# EasyEDA schematic 1-Schematic_RGB SENSOR PEN.json
TITLE: Sheet_1; REV: 1.0; Date: 2021-05-16; Sheet: 1/1; Drawn By: saravanan pushpakumar; Company: Your Company
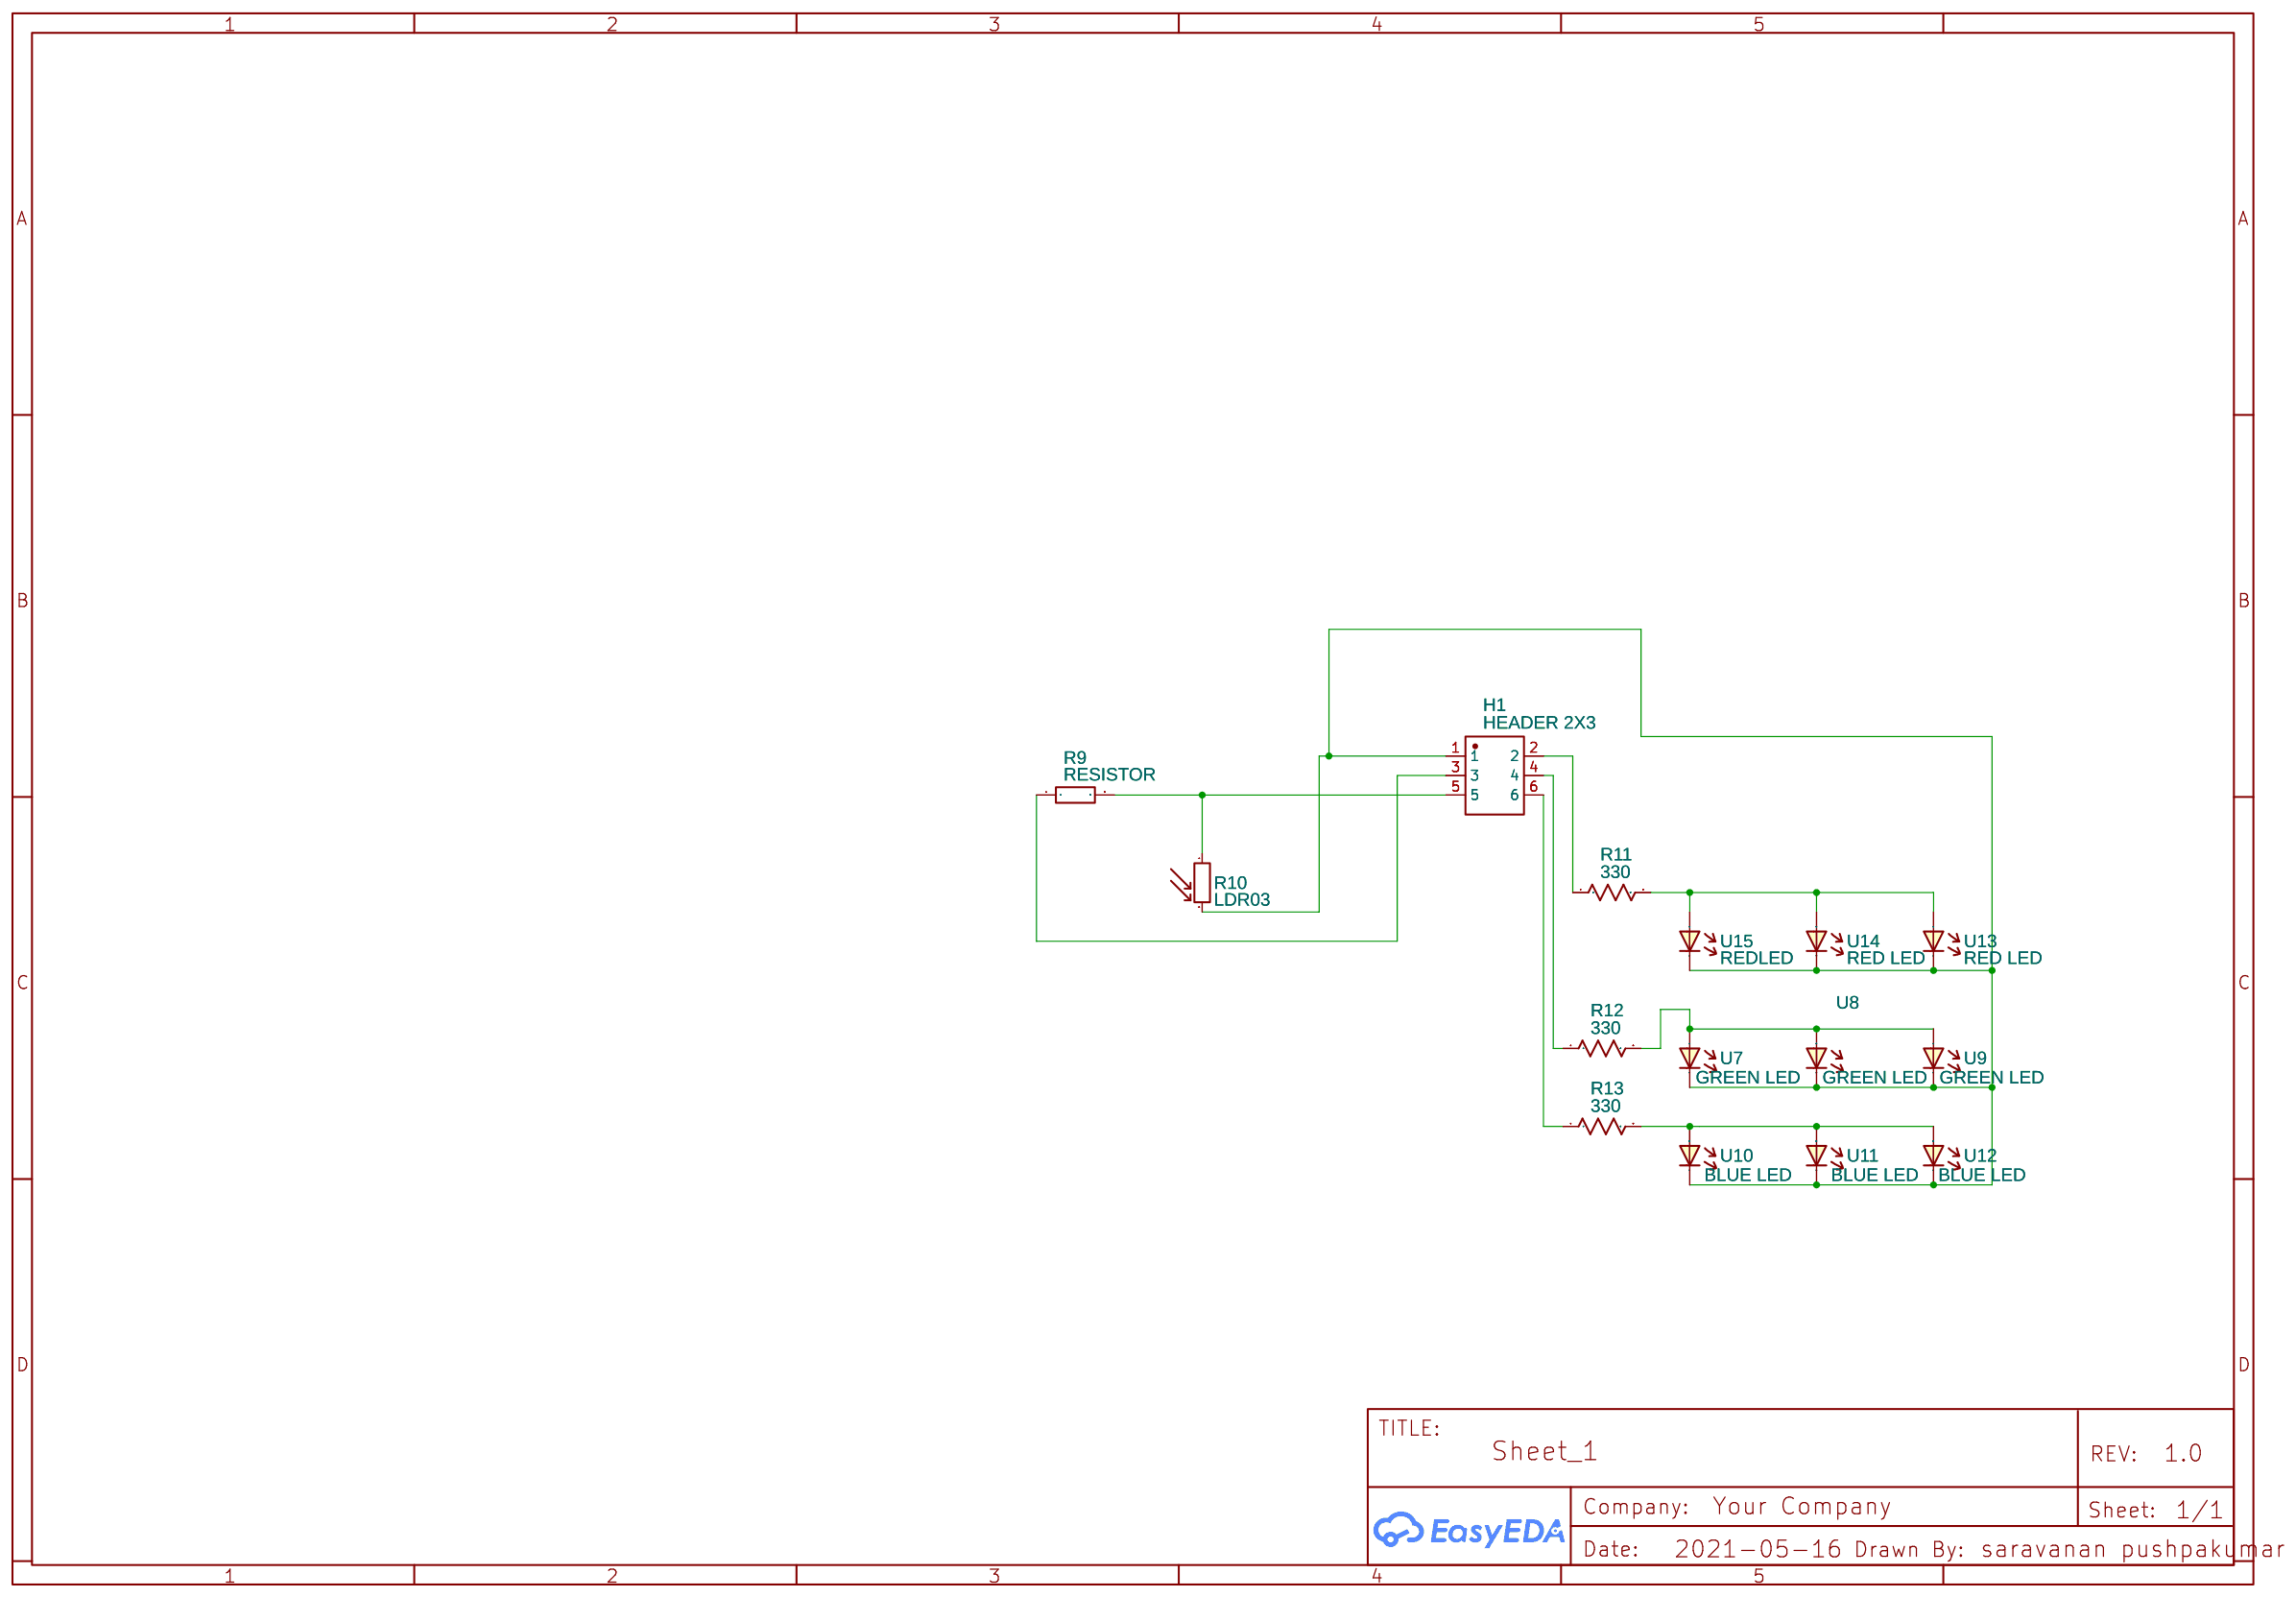
[diagram p0: schematic sheet]

## Parts
H1  HEADER 2X3  [HDR-TH_6P-P2.54-V-R2-C3-S2.54]
R9  RESISTOR  [AXIAL-0.4]
R10  LDR03  [RESISTOR_LDR_10X8.5_RM7.6]
R11  330  [PKG-0.25W RESISTOR]
R12  330  [PKG-0.25W RESISTOR]
R13  330  [PKG-0.25W RESISTOR]
U7  GREEN LED  [5MM LED]
U8  GREEN LED  [5MM LED]
U9  GREEN LED  [5MM LED]
U10  BLUE LED  [5MM LED]
U11  BLUE LED  [5MM LED]
U12  BLUE LED  [5MM LED]
U13  RED LED  [5MM LED]
U14  RED LED  [5MM LED]
U15  REDLED  [5MM LED]

## Library data of the parts
H1 = HEADER 2X3: Supplier Part: C47552; Supplier: LCSC; Manufacturer: ReliaPro; Manufacturer Part: Female header/2.54mm2x3 Female header
R9 = RESISTOR: Power: 1/4W; Tolerance: ±1%; EasyEDA: E57439; Supplier Part: E57439; Supplier: EasyEDA; Manufacturer: UniOhm; Manufacturer Part: MFR0W4F2200A50
R10 = LDR03: Contributor: KiCAD; license: https://www.gnu.org/licenses/lgpl-2.1.html
R11-R13 = 330: Power: 1/4W; Tolerance: ±5%; Supplier Part: 9339116; Supplier: Element14; Manufacturer: MULTICOMP; Manufacturer Part: MCF 0.25W 120R; Link: http://www.farnell.com/datasheets/1716725.pdf?_ga=2.130313612.2023696496.1506695686-238689616.1505921947&_gac=1.45287312.1506011718.EAIaIQobChMI57GX6tq21gIVTzobCh2WXgT2EAAYASAAEgKn9_D_BwE; Contributor: Prof. Ing. F. Scordino
U7-U15 = LED: Manufacturer Part: 5mm LED; Contributor: Axbri

## Nets
Net-(H1-1): H1.1 R10.2 U7.2 U8.2 U9.2 U10.2 U11.2 U12.2 U13.2 U14.2 U15.2
Net-(H1-2): H1.2 R11.1
Net-(H1-3): H1.3 R9.1
Net-(H1-4): H1.4 R12.1
Net-(H1-5): H1.5 R9.2 R10.1
Net-(H1-6): H1.6 R13.1
Net-(R11-2): R11.2 U13.1 U14.1 U15.1
Net-(R12-2): R12.2 U7.1 U8.1 U9.1
Net-(R13-2): R13.2 U10.1 U11.1 U12.1
